# Altium schematic sheet TP_IHM_BUZZER.SchDoc
size A4
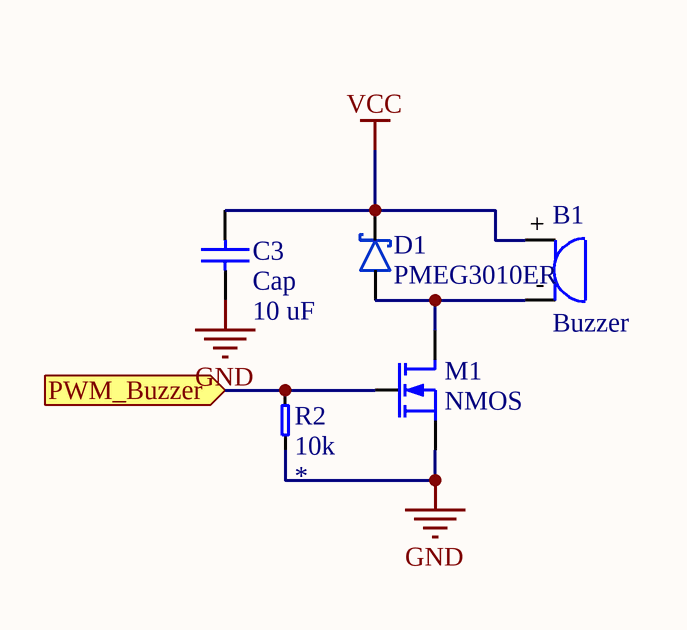
[diagram p0: TP_IHM_BUZZER.SchDoc]

## Parts
B1  Buzzer  [SD160709]
C3  Cap  value 10 uF  [RAD-0.3]
D1  PMEG3010ER  [SOD123W]
M1  NMOS  [MOSFET-SOT23]
R2  value 10k  [0603_RES_LD]  (hidden comment: Resistor)

## Ports
PWM_Buzzer

## Nets
GND: C3.1 M1.S R2.1
VCC: B1.+ C3.2 D1.K
PWM_Buzzer: M1.G R2.2 ; port PWM_Buzzer
NetB1_-: B1.- D1.A M1.D

## Library data of the parts
B1 = SD160709: TDK SD160709 Buzzer; Reference: SD160709
C3 = Cap: Capacitor; Published: 8-Jun-2000; LatestRevisionDate: 17-Jul-2002; LatestRevisionNote: Re-released for DXP Platform.; PackageReference: RAD-0.3; Publisher: Altium Limited; PackageDescription: Radial Cap, Thru-Hole; 2 Leads; 0.3 in Pin Spacing
D1 = Schottky_PMEG3010ER: Nexperia 1A low Vf Mega Schottky barrier rectifier; Reference: PMEG3010ER
M1 = N-MOSFET: N MOSFET
R2 = Resistor: Precision: *; Package: *